# EAGLE board DMM-8E-2 (EAGLE 6.6.0)
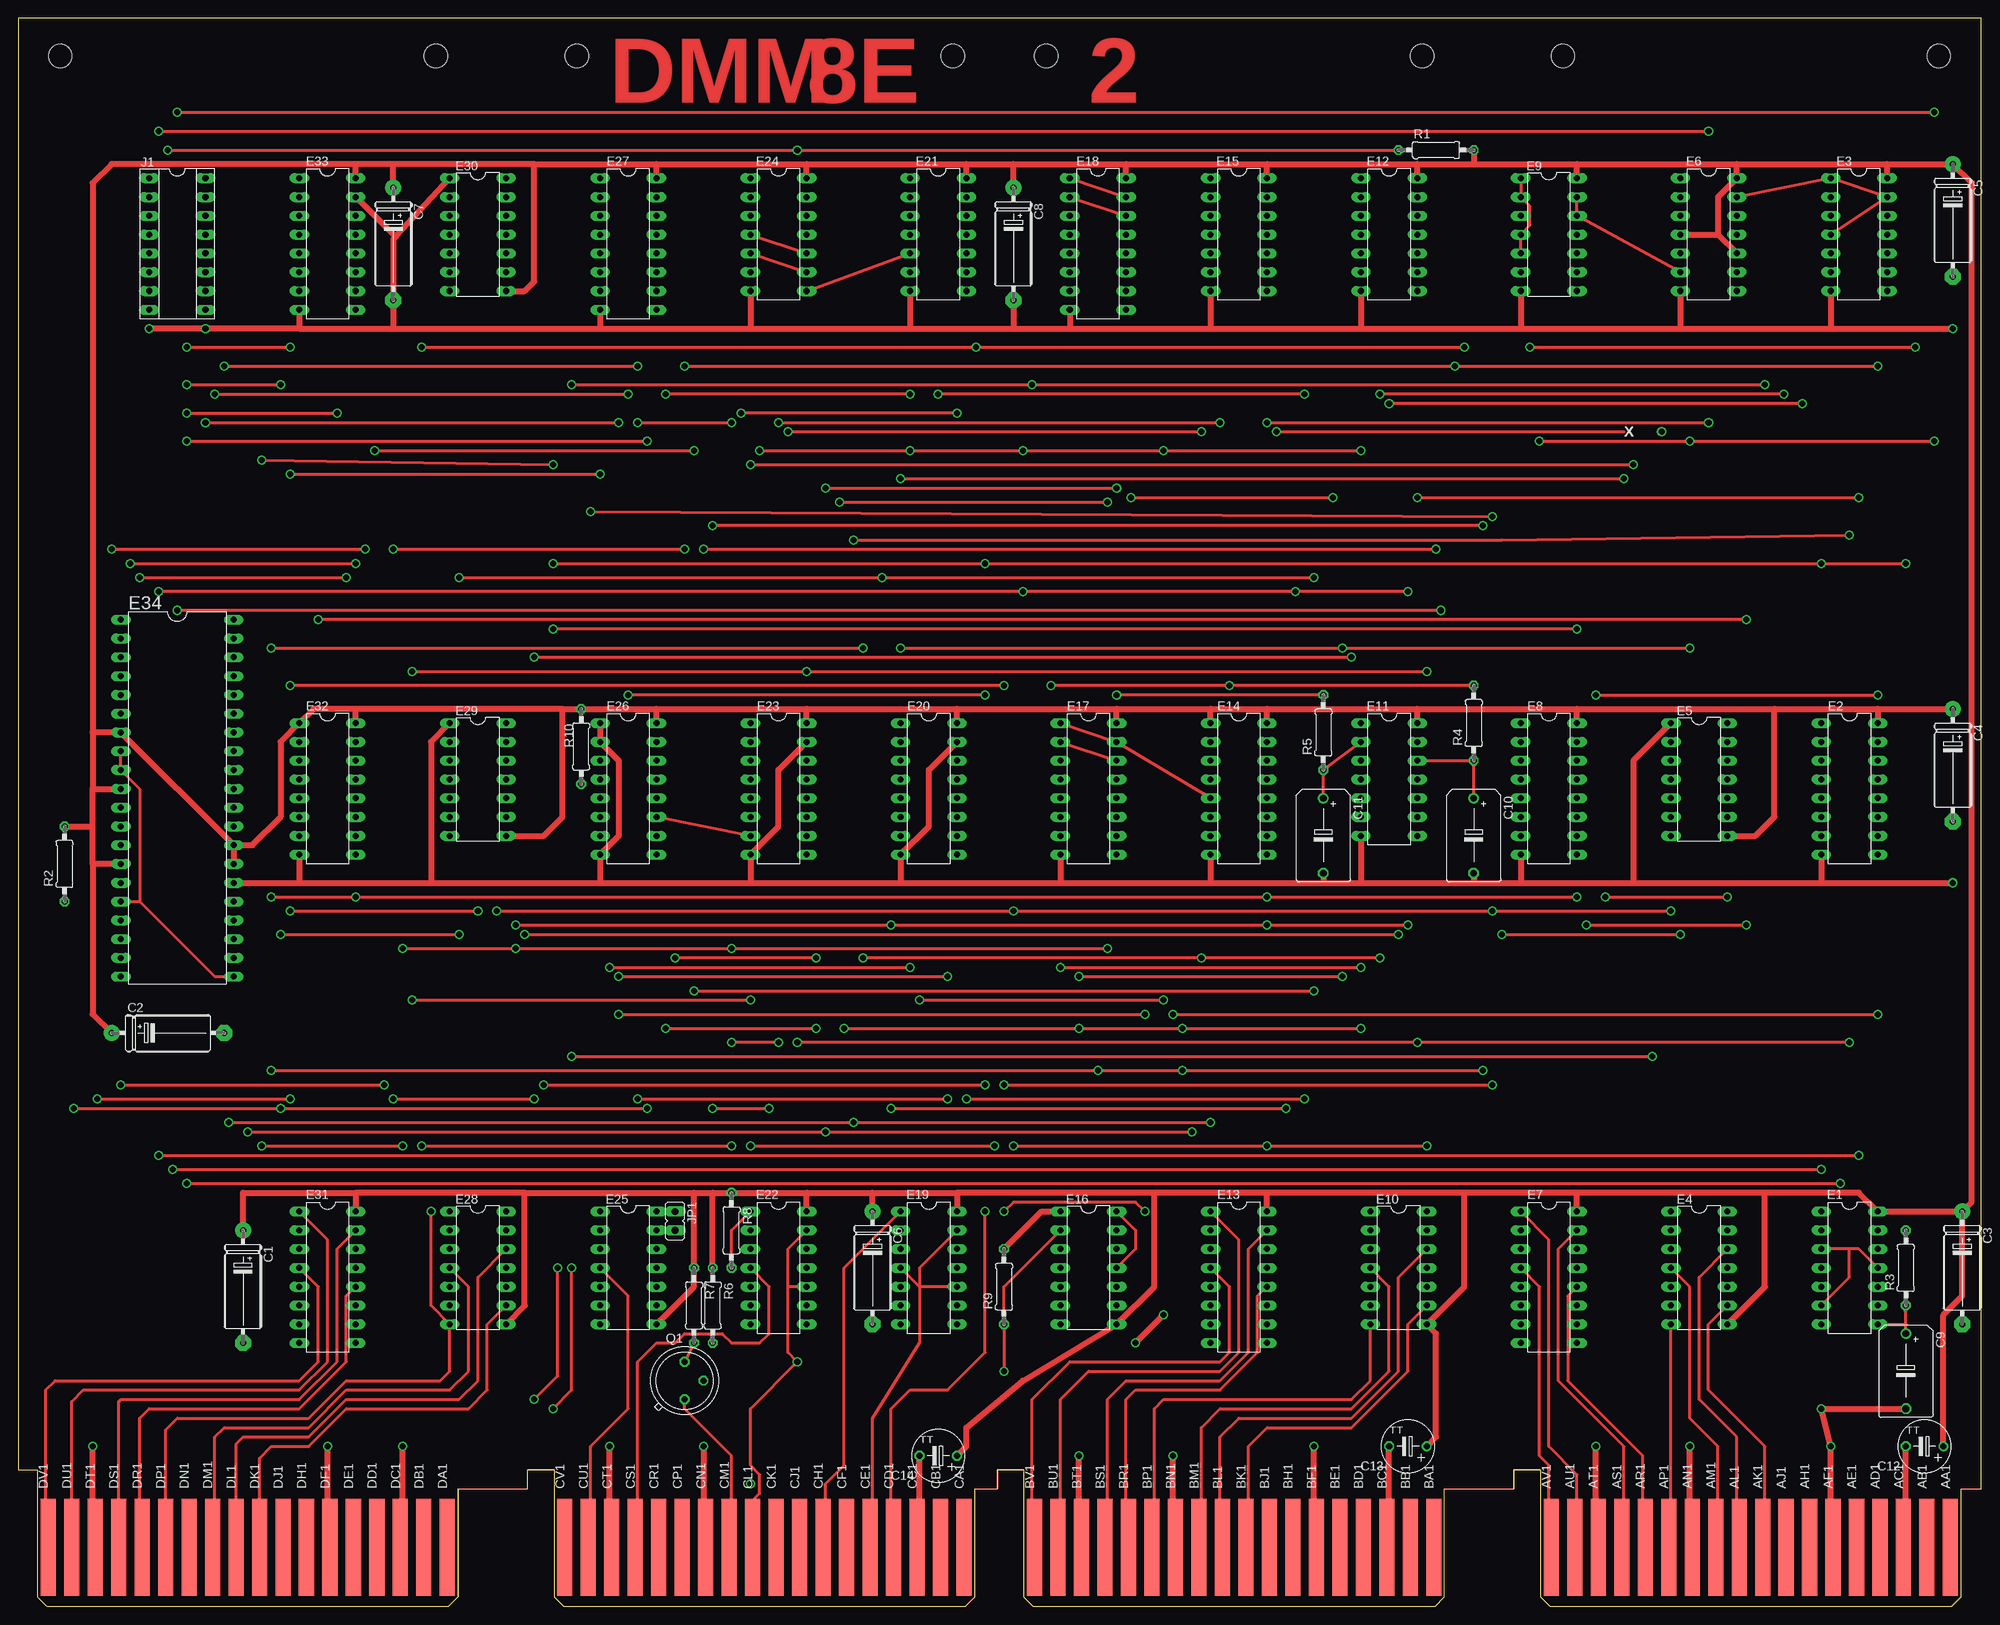
[diagram p2: board, top side]
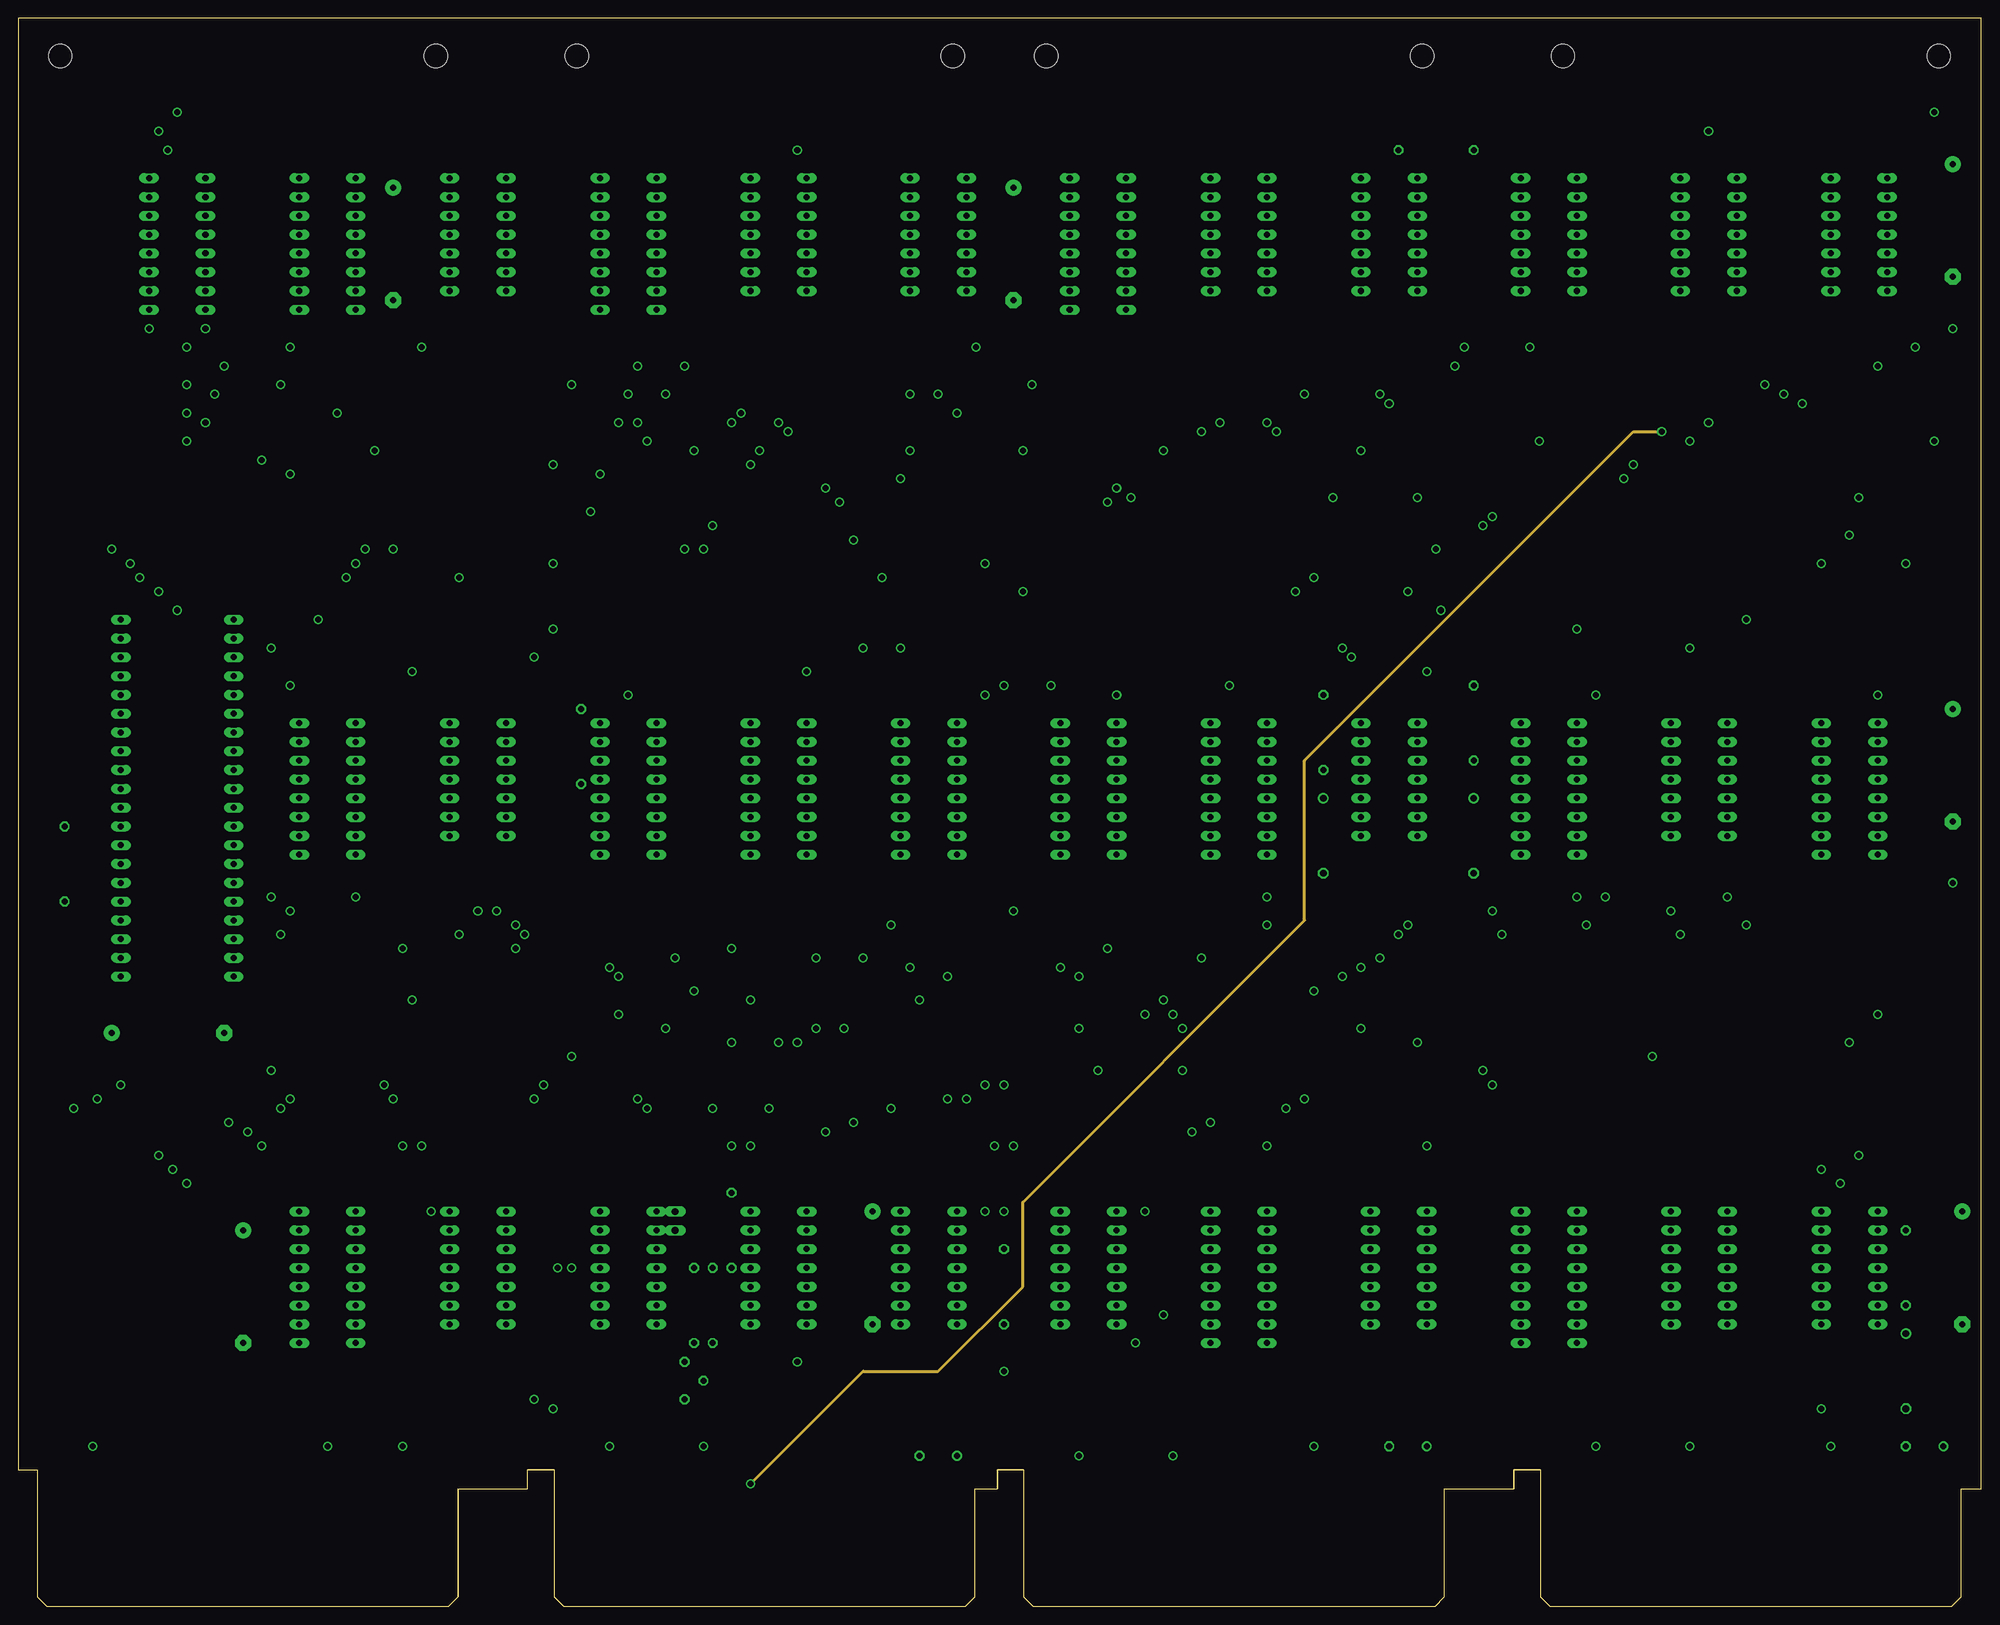
[diagram p3: board, inner layer Route15]
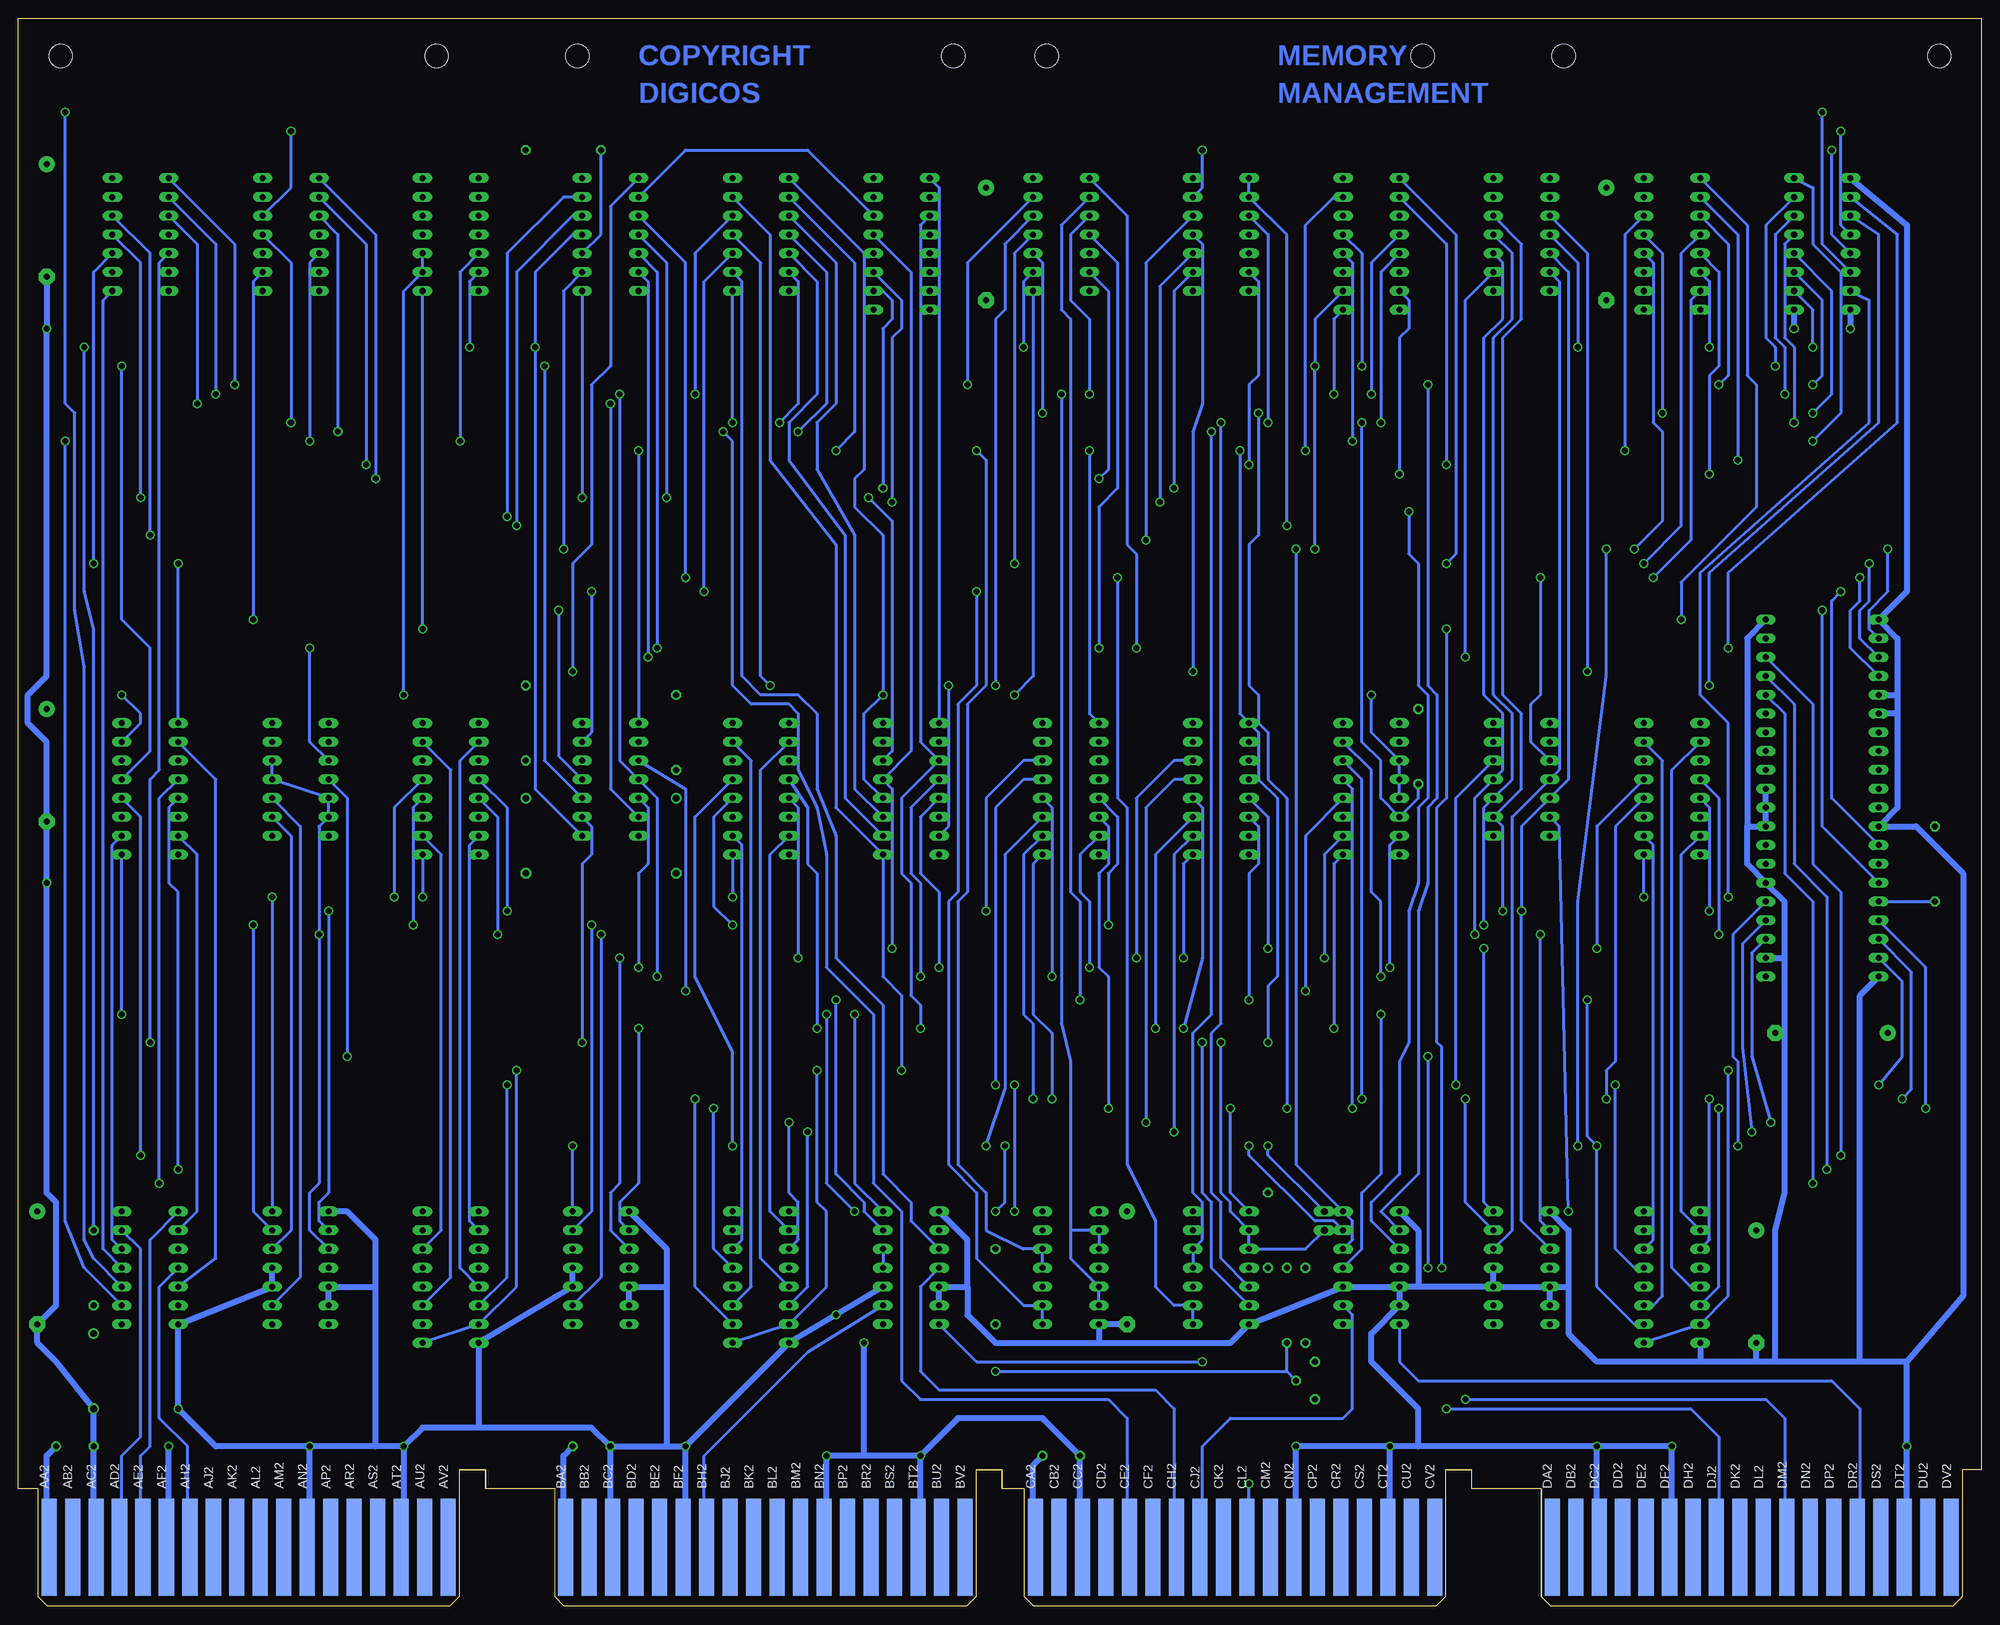
[diagram p4: board, bottom side, seen from below]

Size 265.3 x 214.63 mm. Coordinates in mm from the lower left corner, seen from the top.
Copper layers (1+15+16): Top 0.035mm / dielectric 1.5mm / Route15 0.035mm / dielectric 0.2mm / Bottom 0.035mm
Design rules "16mils *": minimum track width 16mil, minimum drill 32mil, track to track 15mil, track to pad 10mil, pad to pad 10mil, via to via 10mil, smd to smd 10mil, copper to edge 13mil, drill to drill 10mil, minimum pad ring 10mil, minimum via ring 8mil, stop-mask expansion 0mil, vias tented up to drill 0mil, thermal gap 10mil

## Footprints (pad centres in the part's own frame; a part is rotated, then mirrored left to right if it is on the bottom)
E15-5 = drill 0.813 pad 2.159: + -7.62,0 | drill 0.813 pad 2.159 octagon: - 7.62,0
B45181C = drill 0.914: + -5.08,0 | drill 0.914 octagon: - 5.08,0
TT5D7 = drill 0.813: + -2.54,0 | drill 0.813 octagon: - 2.54,0
DIL14 = drill 0.813 long: 1 -7.62,-3.81; 2 -5.08,-3.81; 3 -2.54,-3.81; 4 0,-3.81; 5 2.54,-3.81; 6 5.08,-3.81; 7 7.62,-3.81; 8 7.62,3.81; 9 5.08,3.81; 10 2.54,3.81; 11 0,3.81; 12 -2.54,3.81; 13 -5.08,3.81; 14 -7.62,3.81
DIL16 = drill 0.813 long: 1 -8.89,-3.81; 2 -6.35,-3.81; 3 -3.81,-3.81; 4 -1.27,-3.81; 5 1.27,-3.81; 6 3.81,-3.81; 7 6.35,-3.81; 8 8.89,-3.81; 9 8.89,3.81; 10 6.35,3.81; 11 3.81,3.81; 12 1.27,3.81; 13 -1.27,3.81; 14 -3.81,3.81; 15 -6.35,3.81; 16 -8.89,3.81
DIL40 = drill 0.813 long: 1 -24.13,-7.62; 2 -21.59,-7.62; 3 -19.05,-7.62; 4 -16.51,-7.62; 5 -13.97,-7.62; 6 -11.43,-7.62; 7 -8.89,-7.62; 8 -6.35,-7.62; 9 -3.81,-7.62; 10 -1.27,-7.62; 11 1.27,-7.62; 12 3.81,-7.62; 13 6.35,-7.62; 14 8.89,-7.62; 15 11.43,-7.62; 16 13.97,-7.62; 17 16.51,-7.62; 18 19.05,-7.62; 19 21.59,-7.62; 20 24.13,-7.62; 21 24.13,7.62; 22 21.59,7.62; 23 19.05,7.62; 24 16.51,7.62; 25 13.97,7.62; 26 11.43,7.62; 27 8.89,7.62; 28 6.35,7.62; 29 3.81,7.62; 30 1.27,7.62; 31 -1.27,7.62; 32 -3.81,7.62; 33 -6.35,7.62; 34 -8.89,7.62; 35 -11.43,7.62; 36 -13.97,7.62; 37 -16.51,7.62; 38 -19.05,7.62; 39 -21.59,7.62; 40 -24.13,7.62
SOCKET-16 = drill 0.813 long: 1 -8.89,-3.81; 2 -6.35,-3.81; 3 -3.81,-3.81; 4 -1.27,-3.81; 5 1.27,-3.81; 6 3.81,-3.81; 7 6.35,-3.81; 8 8.89,-3.81; 9 8.89,3.81; 10 6.35,3.81; 11 3.81,3.81; 12 1.27,3.81; 13 -1.27,3.81; 14 -3.81,3.81; 15 -6.35,3.81; 16 -8.89,3.81
JP1 = drill 0.914 long: 1 0,-1.27; 2 0,1.27
TO5 = drill 0.813 octagon: 1 0,-2.54; 2 2.54,0; 3 0,2.54
0207/10 = drill 0.813 octagon: 1 -5.08,0; 2 5.08,0
OMNIBUS = hole 3.175: 208.915,209.55; 259.715,209.55; 189.865,209.55; 139.065,209.55; 75.616,209.55; 126.416,209.55; 56.566,209.55; 5.766,209.55
EDGE-CON8 = smd 2.032 x 13.106: AA1 261.303,7.938; AB1 258.127,7.938; AC1 254.952,7.938; AD1 251.778,7.938; AE1 248.602,7.938; AF1 245.428,7.938; AH1 242.252,7.938; AJ1 239.077,7.938; AK1 235.903,7.938; AL1 232.727,7.938; AM1 229.553,7.938; AN1 226.377,7.938; AP1 223.202,7.938; AR1 220.028,7.938; AS1 216.852,7.938; AT1 213.678,7.938; AU1 210.502,7.938; AV1 207.327,7.938; BA1 191.452,7.938; BB1 188.278,7.938; BC1 185.102,7.938; BD1 181.928,7.938; BE1 178.752,7.938; BF1 175.577,7.938; BH1 172.403,7.938; BJ1 169.227,7.938; BK1 166.053,7.938; BL1 162.877,7.938; BM1 159.702,7.938; BN1 156.528,7.938; BP1 153.352,7.938; BR1 150.178,7.938; BS1 147.002,7.938; BT1 143.827,7.938; BU1 140.653,7.938; BV1 137.477,7.938; CA1 127.953,7.938; CB1 124.778,7.938; CC1 121.603,7.938; CD1 118.427,7.938; CE1 115.252,7.938; CF1 112.078,7.938; CH1 108.903,7.938; CJ1 105.728,7.938; CK1 102.552,7.938; CL1 99.377,7.938; CM1 96.203,7.938; CN1 93.028,7.938; CP1 89.853,7.938; CR1 86.677,7.938; CS1 83.502,7.938; CT1 80.328,7.938; CU1 77.153,7.938; CV1 73.978,7.938; DA1 58.102,7.938; DB1 54.928,7.938; DC1 51.752,7.938; DD1 48.578,7.938; DE1 45.403,7.938; DF1 42.227,7.938; DH1 39.053,7.938; DJ1 35.877,7.938; DK1 32.703,7.938; DL1 29.527,7.938; DM1 26.352,7.938; DN1 23.177,7.938; DP1 20.003,7.938; DR1 16.828,7.938; DS1 13.652,7.938; DT1 10.477,7.938; DU1 7.303,7.938; DV1 4.128,7.938 | smd 2.032 x 13.106 bottom: AA2 261.303,7.938; AB2 258.127,7.938; AC2 254.952,7.938; AD2 251.778,7.938; AE2 248.602,7.938; AF2 245.428,7.938; AH2 242.252,7.938; AJ2 239.077,7.938; AK2 235.903,7.938; AL2 232.727,7.938; AM2 229.553,7.938; AN2 226.377,7.938; AP2 223.202,7.938; AR2 220.028,7.938; AS2 216.852,7.938; AT2 213.678,7.938; AU2 210.502,7.938; AV2 207.327,7.938; BA2 191.452,7.938; BB2 188.278,7.938; BC2 185.102,7.938; BD2 181.928,7.938; BE2 178.752,7.938; BF2 175.577,7.938; BH2 172.403,7.938; BJ2 169.227,7.938; BK2 166.053,7.938; BL2 162.877,7.938; BM2 159.702,7.938; BN2 156.528,7.938; BP2 153.352,7.938; BR2 150.178,7.938; BS2 147.002,7.938; BT2 143.827,7.938; BU2 140.653,7.938; BV2 137.477,7.938; CA2 127.953,7.938; CB2 124.778,7.938; CC2 121.603,7.938; CD2 118.427,7.938; CE2 115.252,7.938; CF2 112.078,7.938; CH2 108.903,7.938; CJ2 105.728,7.938; CK2 102.552,7.938; CL2 99.377,7.938; CM2 96.203,7.938; CN2 93.028,7.938; CP2 89.853,7.938; CR2 86.677,7.938; CS2 83.502,7.938; CT2 80.328,7.938; CU2 77.153,7.938; CV2 73.978,7.938; DA2 58.102,7.938; DB2 54.928,7.938; DC2 51.752,7.938; DD2 48.578,7.938; DE2 45.403,7.938; DF2 42.227,7.938; DH2 39.053,7.938; DJ2 35.877,7.938; DK2 32.703,7.938; DL2 29.527,7.938; DM2 26.352,7.938; DN2 23.177,7.938; DP2 20.003,7.938; DR2 16.828,7.938; DS2 13.652,7.938; DT2 10.477,7.938; DU2 7.303,7.938; DV2 4.128,7.938

## Placement (x,y rotation side)
C1  10uF  [E15-5]  30.35,43.18 270 top
C2  10uF  [E15-5]  20.19,77.47 0 top
C3  10uF  [E15-5]  262.76,45.72 270 top
C4  10uF  [E15-5]  261.49,113.67 270 top
C5  10uF  [E15-5]  261.49,187.32 270 top
C6  10uF  [E15-5]  115.44,45.72 270 top
C7  10uF  [E15-5]  50.67,184.15 270 top
C8  10uF  [E15-5]  134.49,184.15 270 top
C9  820pF  [B45181C]  255.14,31.75 270 top
C10  820pF  [B45181C]  196.72,104.14 270 top
C11  820pF  [B45181C]  176.4,104.14 270 top
C12  15uF  [TT5D7]  257.68,21.59 180 top
C13  15uF  [TT5D7]  187.83,21.59 180 top
C14  15uF  [TT5D7]  124.33,20.32 180 top
E1  7401N  [DIL14]  247.52,45.72 270 top
E2  74175N  [DIL16]  247.52,110.49 270 top
E3  7474N  [DIL14]  248.79,185.42 270 top
E4  SP380N  [DIL14]  227.2,45.72 270 top
E5  SP314N  [DIL14]  227.2,111.76 270 top
E6  7474N  [DIL14]  228.47,185.42 270 top
E7  DS8641N  [DIL16]  206.88,44.45 270 top
E8  74175N  [DIL16]  206.88,110.49 270 top
E9  74H40N  [DIL14]  206.88,185.42 270 top
E10  SP380N  [DIL14]  186.56,45.72 270 top
E11  7400N  [DIL14]  185.29,111.76 270 top
E12  7404N  [DIL14]  185.29,185.42 270 top
E13  DS8641N  [DIL16]  164.97,44.45 270 top
E14  74175N  [DIL16]  164.97,110.49 270 top
E15  7404N  [DIL14]  164.97,185.42 270 top
E16  SP380N  [DIL14]  144.65,45.72 270 top
E17  74155N  [DIL16]  144.65,110.49 270 top
E18  74155N  [DIL16]  145.92,184.15 270 top
E19  7401N  [DIL14]  123.06,45.72 270 top
E20  74LS257N  [DIL16]  123.06,110.49 270 top
E21  7408N  [DIL14]  124.33,185.42 270 top
E22  7401N  [DIL14]  102.74,45.72 270 top
E23  74LS257N  [DIL16]  102.74,110.49 270 top
E24  7410N  [DIL14]  102.74,185.42 270 top
E25  SP380N  [DIL14]  82.42,45.72 270 top
E26  I3107  [DIL16]  82.42,110.49 270 top
E27  74175N  [DIL16]  82.42,184.15 270 top
E28  SP380N  [DIL14]  62.1,45.72 270 top
E29  SP314N  [DIL14]  62.1,111.76 270 top
E30  SP314N  [DIL14]  62.1,185.42 270 top
E31  DS8641N  [DIL16]  41.78,44.45 270 top
E32  74175N  [DIL16]  41.78,110.49 270 top
E33  74LS257N  [DIL16]  41.78,184.15 270 top
E34  AM2901  [DIL40]  21.46,109.22 270 top
J1  [SOCKET-16]  21.46,184.15 270 top
JP1  [JP1]  88.77,52.07 180 top
Q1  OPEN  [TO5]  90.04,30.48 0 top
R1  2.2K  [0207/10]  191.64,196.85 0 top
R2  680  [0207/10]  6.22,100.33 90 top
R3  220  [0207/10]  255.14,45.72 90 top
R4  220  [0207/10]  196.72,119.38 90 top
R5  220  [0207/10]  176.4,118.11 90 top
R6  220  [0207/10]  93.85,40.64 270 top
R7  10  [0207/10]  91.31,40.64 270 top
R8  2400  [0207/10]  96.39,50.8 270 top
R9  470  [0207/10]  133.22,43.18 90 top
R10  680  [0207/10]  76.07,116.2 270 top
U$1  OUTLINE-OMNIBUS  [OMNIBUS]  -0.13,0 0 top
U$2  QUAD  [EDGE-CON8]  -0.13,0 0 top

## Tracks (layer width: path | path; a pad name or v marks a point on that pad's centre or on a via)
!BCPMA_DISABLE  (via drill 0.81)
  Top 0.406: v197.99,146.05 v93.85,146.05
  Bottom 0.406: E12.12 190.37,187.96 197.99,180.34 v197.99,146.05 | v93.85,146.05 93.85,185.42 E24.2 E24.1
!C0
  Top 0.406: U$2.CE1 115.44,8.26 115.44,25.4 121.79,35.56 121.79,43.18 | E19.4 121.79,43.18 | E19.13 121.79,45.72 121.79,43.18 | E19.10 121.79,43.18
!C1
  Top 0.406: U$2.CH1 109.09,8.26 109.09,16.51 111.63,19.05 111.63,45.72 E19.1
!CMME  (via drill 0.81)
  Top 0.406: v143.38,85.09 v178.94,85.09 | v238.63,163.83 v184.02,163.83
  Bottom 0.406: E3.2 238.63,184.15 v238.63,163.83 | v184.02,163.83 184.02,114.3 E11.4 178.94,109.22 v178.94,85.09 | E17.4 144.65,107.95 144.65,99.06 143.38,97.79 v143.38,85.09
!CPMA_DISABLE
  Top 0.406: U$2.CU1 77.34,8.26 77.34,21.59 82.42,26.67 82.42,41.91 E25.4
!DATA00
  Top 0.406: E7.12 209.42,41.91 209.42,30.48 219.58,20.32 219.58,8.26 U$2.AR1
!DATA01
  Top 0.406: U$2.AS1 217.04,8.26 217.04,21.59 208.15,30.48 208.15,48.26 E7.15
!DATA02
  Top 0.406: U$2.AU1 210.69,8.26 210.69,17.78 206.88,21.59 206.88,49.53 E7.1
!DATA03
  Top 0.406: U$2.AV1 206.88,8.26 206.88,19.05 205.61,20.32 205.61,43.18 E7.4
!DATA04
  Top 0.406: U$2.BR1 149.73,8.26 149.73,27.94 151,29.21 162.43,29.21 167.51,34.29 167.51,41.91 E13.12
!DATA05
  Top 0.406: U$2.BS1 147.19,8.26 147.19,27.94 149.73,30.48 162.43,30.48 166.24,34.29 166.24,48.26 E13.15
!DATA06
  Top 0.406: U$2.BU1 140.84,8.26 140.84,27.94 144.65,31.75 162.43,31.75 164.97,34.29 164.97,49.53 E13.1
!DATA07
  Top 0.406: U$2.BV1 137.03,8.26 137.03,27.94 142.11,33.02 162.43,33.02 163.7,34.29 163.7,43.18 E13.4
!DATA08
  Top 0.406: U$2.DR1 16.38,8.89 16.38,25.4 16.7,25.72 17.65,26.67 37.97,26.67 44.32,33.02 44.32,41.91 E31.12
!DATA09
  Top 0.406: U$2.DS1 13.52,27.62 13.84,27.94 37.97,27.94 43.05,33.02 43.05,48.26 E31.15
!DATA10
  Top 0.406: U$2.DU1 7.18,27.62 8.76,29.21 37.97,29.21 41.78,33.02 41.78,49.53 E31.1
!DATA11
  Top 0.406: U$2.DV1 4,8.57 3.68,8.89 3.68,29.21 4.95,30.48 37.97,30.48 40.51,33.02 40.51,43.18 E31.4
!EMA0
  Bottom 0.406: U$2.AD2 251.33,8.26 251.33,20.32 248.79,22.86 248.79,48.26 E1.13
!EMA1
  Bottom 0.406: E1.1 247.52,49.53 247.52,21.59 248.79,20.32 248.79,8.26 U$2.AE2
!EMA2
  Bottom 0.406: E1.4 246.25,43.18 246.25,25.4 242.44,21.59 242.44,8.26 U$2.AH2
!F  (via drill 0.81)
  Top 0.406: v72.26,26.67 74.8,29.21 v74.8,45.72 | v74.8,74.3 v220.85,74.3
  Bottom 0.406: v72.26,26.67 39.24,26.67 35.43,22.86 35.43,8.26 U$2.DJ2 | v74.8,74.3 v74.8,45.72 | E5.4 220.85,109.22 v220.85,74.3
!F_SET
  Bottom 0.406: E25.7 78.61,33.02 76.07,30.48 20.19,30.48 16.38,26.67 16.38,8.26 U$2.DR2
!IFDF_CLR  (via drill 0.81)
  Top 0.406: v133.22,124.46 v36.7,124.46
  Bottom 0.406: v36.7,124.46 36.7,139.7 13.84,160.02 13.84,185.42 J1.3 | E21.12 131.95,184.15 131.95,175.26 133.22,173.99 v133.22,124.46
!INTERNAL_IO  (via drill 0.81)
  Top 0.406: U$2.CL1 98.93,8.26 98.93,13.97 100.2,15.24 100.2,17.78 98.93,19.05 98.93,26.67 v105.28,33.02 104.01,34.29 104.01,43.18 | 104.01,43.18 104.01,48.26 E22.13 | E22.10 104.01,43.18
  Bottom 0.406: E16.7 135.76,33.02 v105.28,33.02
!IO_PAUSE  (via drill 0.81)
  Top 0.406: U$2.CD1 117.98,8.26 117.98,26.67 120.52,29.21 125.6,29.21 130.68,34.29 v130.68,53.34 | v70.99,70.48 v130.68,70.48
  Bottom 0.406: v70.99,70.48 70.99,109.22 E29.12 | v130.68,70.48 v130.68,53.34
!IOT2X5  (via drill 0.81)
  Top 0.406: v150.37,149.86 v177.67,149.86 | E17.2 E17.14
  Bottom 0.406: E17.14 147.19,115.57 147.19,146.69 v150.37,149.86 | E12.4 177.67,181.61 v177.67,149.86
!IOT21_45  (via drill 0.81)
  Top 0.406: v109.09,151.13 v148.46,151.13 | E24.5 E24.9
  Bottom 0.406: E18.10 148.46,177.8 147.19,176.53 147.19,173.99 148.46,172.72 v148.46,151.13 | E24.9 109.09,177.8 v109.09,151.13
!IOT22_45  (via drill 0.81)
  Top 0.406: v111,149.22 v147.19,149.22 | E24.4 E24.10
  Bottom 0.406: E18.11 145.92,176.53 145.92,172.72 147.19,171.45 v147.19,149.22 | E24.10 111,178.44 v111,149.22
!LOAD_CNTL  (via drill 0.81)
  Top 0.406: v81.15,80.01 v152.27,80.01 | E16.14 151,50.8 151,48.26 E16.11
  Bottom 0.406: v152.27,80.01 152.27,57.15 E16.14 | v81.15,80.01 81.15,58.42 83.69,55.88 83.69,48.26 E25.11 | E16.12 E16.11
!LRM  (via drill 0.81)
  Top 0.406: R4.2 v163.7,124.46 v139.57,124.46
  Bottom 0.406: v163.7,124.46 164.97,125.73 164.97,181.61 E15.11 | v139.57,124.46 139.57,105.41 E17.7
!LTM  (via drill 0.81)
  Top 0.406: R5.2 v148.46,123.19
  Bottom 0.406: E17.12 151,111.76 151,120.65 v148.46,123.19 148.46,144.78 152.27,148.59 152.27,152.4 151,153.67 151,182.88 E15.1
!MASKED  (via drill 0.81)
  Top 0.406: v98.93,154.31 v218.31,154.31
  Bottom 0.406: E6.2 218.31,184.15 v218.31,154.31 | E24.6 97.66,179.07 97.66,166.37 98.93,165.1 v98.93,154.31
!MD00
  Top 0.406: U$2.AK1 236.09,8.26 236.09,21.59 228.47,29.21 228.47,38.1 E4.9
  Bottom 0.406: E5.10 227.2,105.41 227.2,44.45 E4.9
!MD01
  Top 0.406: U$2.AL1 232.28,8.26 232.28,22.86 227.2,27.94 227.2,44.45 E4.12
  Bottom 0.406: E5.9 228.47,104.14 228.47,50.8 E4.12
!MD02
  Top 0.406: U$2.AM1 229.74,8.26 229.74,21.59 225.93,25.4 225.93,43.18 E4.4
!MD03
  Top 0.406: U$2.AP1 223.39,8.26 E4.7
!MD04  (via drill 0.81)
  Top 0.406: U$2.BK1 166.24,8.26 166.24,21.59 168.78,24.13 180.21,24.13 187.83,31.75 187.83,38.1 E10.9 | v68.45,90.81 v186.56,90.81
  Bottom 0.406: E10.9 186.56,44.45 v186.56,90.81 | E30.10 64.64,181.61 64.64,173.99 67.18,171.45 67.18,123.19 64.64,120.65 64.64,113.03 E29.11 68.45,109.22 v68.45,90.81
!MD05
  Top 0.406: U$2.BL1 162.43,8.26 162.43,22.86 164.97,25.4 180.21,25.4 186.56,31.75 186.56,44.45 E10.12
!MD06
  Top 0.406: U$2.BM1 159.89,8.26 159.89,24.13 162.43,26.67 180.21,26.67 185.29,31.75 185.29,43.18 E10.4
!MD07
  Top 0.406: U$2.BP1 153.54,8.89 153.54,26.67 154.81,27.94 180.21,27.94 182.75,30.48 E10.7
!MD08
  Top 0.406: U$2.DK1 32.58,20 34.16,21.59 39.24,21.59 44.32,26.67 60.83,26.67 63.37,29.21 63.37,38.1 E28.9
!MD09
  Top 0.406: U$2.DL1 29.4,21.91 30.35,22.86 39.24,22.86 44.32,27.94 59.56,27.94 62.1,30.48 62.1,44.45 E28.12
  Bottom 0.406: E28.12 63.37,50.8 63.37,106.68 E29.4 57.02,113.03 57.02,179.07 E30.6
!MD10
  Top 0.406: U$2.DM1 26.54,8.89 26.54,22.86 27.81,24.13 39.24,24.13 44.32,29.21 58.29,29.21 60.83,31.75 60.83,43.18 E28.4
!MD11  (via drill 0.81)
  Top 0.406: U$2.DP1 19.88,23.81 21.46,25.4 39.24,25.4 44.32,30.48 57.02,30.48 58.29,31.75 E28.7 55.75,40.64 v55.75,53.34
  Bottom 0.406: v55.75,53.34 57.02,105.41 E29.6
!NOT_LAST_XFR
  Top 0.406: U$2.CM1 96.39,8.26 96.39,20.32 90.04,26.67 Q1.1
!RTM  (via drill 0.81)
  Top 0.406: v34.16,72.39 v145.92,72.39 v157.35,72.39 v197.99,72.39
  Bottom 0.406: E31.9 E31.7 34.16,41.91 v34.16,72.39 | E7.9 E7.7 197.99,43.18 v197.99,72.39 | E13.9 E13.7 156.08,43.18 156.08,53.34 157.35,54.61 v157.35,72.39 | E15.13 163.7,185.42 163.7,154.94 154.81,143.51 154.81,107.95 E17.9 148.46,85.09 145.92,82.55 v145.92,72.39
!SKIP
  Top 0.406: U$2.CS1 83.69,8.26 83.69,33.02 86.23,35.56 88.77,35.56 90.04,36.83 95.12,36.83 96.39,35.56 100.2,35.56 101.47,36.83 101.47,43.18 E22.4
!SKME
  Bottom 0.406: E17.10 153.54,109.22 153.54,144.78 161.16,154.94 161.16,160.02 157.35,163.83 157.35,179.07 E15.5
!SKMM
  Bottom 0.406: E15.3 154.81,181.61 154.81,162.56 157.35,160.02 157.35,153.67 152.27,144.78 152.27,110.49 E17.11
!SMME  (via drill 0.81)
  Top 0.406: v140.84,86.36 v181.48,86.36
  Bottom 0.406: E11.5 180.21,107.95 180.21,100.33 181.48,99.06 v181.48,86.36 | E17.5 143.38,106.68 143.38,99.06 140.84,96.52 v140.84,86.36
!TP3
  Bottom 0.406: E15.9 167.51,179.07 167.51,125.73 164.97,123.19 159.89,123.19 157.35,120.65 157.35,110.49 154.81,104.14 154.81,87.63 148.46,81.28 148.46,58.42 144.65,54.61 144.65,52.07 E16.3
!TP4  (via drill 0.81)
  Top 0.406: v92.58,142.88 v191.64,142.88
  Bottom 0.406: E12.9 191.64,177.8 v191.64,142.88 | v92.58,142.88 92.58,59.69 E25.14 84.96,52.07 84.96,49.53 E25.12
!TS2  (via drill 0.81)
  Route15 0.406: v98.93,16.51 114.17,31.75 124.33,31.75 135.76,43.18 135.76,54.61 173.86,92.71 173.86,114.3 218.31,158.75 v222.12,158.75
  Bottom 0.406: U$2.CL2 98.93,8.26 v98.93,16.51 | E6.3 222.12,185.42 v222.12,158.75
!USER_MODE  (via drill 0.81)
  Top 0.406: v69.72,27.94 72.9,31.11 v72.9,45.72 | v210.69,132.08 v72.26,132.08
  Bottom 0.406: v69.72,27.94 29.08,27.94 26.54,25.4 26.54,8.26 U$2.DM2 | v72.9,45.72 72.9,75.56 73.53,76.2 73.53,107.95 72.26,109.22 v72.26,132.08 | v210.69,132.08 E9.8
BLOAD_CNTL  (via drill 0.81)
  Top 0.406: v121.79,81.92 v154.81,81.92
  Bottom 0.406: v154.81,81.92 154.81,58.42 151,54.61 151,53.34 E16.13 | E21.2 124.33,186.69 124.33,175.26 123.06,173.99 123.06,96.52 121.79,95.25 v121.79,81.92
BTP3  (via drill 0.81)
  Top 0.406: v168.78,160.02 v228.47,160.02
  Bottom 0.406: E6.11 228.47,181.61 v228.47,160.02 | v168.78,160.02 E15.8
BTP4  (via drill 0.81)
  Top 0.406: v189.1,149.86 v248.79,149.86
  Bottom 0.406: E3.11 248.79,181.61 v248.79,149.86 | E12.8 v189.1,149.86
CPMA_DISABLE  (via drill 0.81)
  Top 0.406: v77.34,147.96 v199.26,147.32
  Bottom 0.406: E12.13 191.64,190.5 199.26,182.88 v199.26,147.32 | v77.34,147.96 77.34,142.24 76.07,140.97 76.07,124.46 74.8,123.19 74.8,109.22 76.07,107.95 76.07,97.79 77.34,93.98 77.34,76.2 78.61,73.66 78.61,58.42 82.42,54.61 82.42,52.07 E25.3
CSMME  (via drill 0.81)
  Top 0.406: v241.17,162.56 v185.29,162.56
  Bottom 0.406: E11.6 185.29,110.49 v185.29,162.56 | E3.3 241.17,184.15 v241.17,162.56
DATA03  (via drill 0.81)
  Top 0.406: v133.22,70.48 v199.26,70.48
  Bottom 0.406: E7.6 199.26,44.45 v199.26,70.48 | E20.13 129.41,111.76 133.22,107.95 v133.22,70.48
DATA04  (via drill 0.81)
  Top 0.406: v128.14,68.58 v173.86,68.58
  Bottom 0.406: E13.10 173.86,43.18 v173.86,68.58 | E20.10 129.41,101.6 129.41,80.01 128.14,78.74 v128.14,68.58
DATA05  (via drill 0.81)
  Top 0.406: v117.98,67.31 v171.32,67.31
  Bottom 0.406: E13.13 171.32,48.26 v171.32,67.31 | E20.6 117.98,105.41 117.98,100.33 119.25,99.06 119.25,86.36 117.98,85.09 v117.98,67.31
DATA06  (via drill 0.81)
  Top 0.406: v28.45,65.41 v112.9,65.41 v161.16,65.41
  Bottom 0.406: E34.23 30.99,88.27 30.99,74.3 v28.45,65.41 | E13.3 159.89,49.53 159.89,54.61 161.16,55.88 v161.16,65.41 | E23.13 109.09,111.76 112.9,107.95 v112.9,65.41
DATA07  (via drill 0.81)
  Top 0.406: v30.99,64.14 v109.09,64.14 v158.62,64.14
  Bottom 0.406: E34.24 32.26,89.53 32.26,75.56 v30.99,64.14 | E13.6 158.62,43.18 v158.62,64.14 | E23.10 109.09,101.6 v109.09,64.14
DATA08  (via drill 0.81)
  Top 0.406: v32.89,62.23 v51.94,62.23 | v53.21,81.92 v98.93,81.92
  Bottom 0.406: E34.25 33.53,90.81 33.53,74.3 32.89,73.66 v32.89,62.23 | E31.10 46.86,38.1 51.94,43.18 v51.94,62.23 53.21,63.5 v53.21,81.92 | E23.6 97.66,105.41 97.66,100.33 98.93,99.06 v98.93,81.92
DATA09  (via drill 0.81)
  Top 0.406: v13.84,70.48 v49.4,70.48
  Bottom 0.406: v13.84,70.48 10.67,74.3 10.67,84.45 E34.19 | E31.13 46.86,45.72 49.4,48.26 v49.4,70.48
DATA10  (via drill 0.81)
  Top 0.406: v10.67,68.58 v36.7,68.58
  Bottom 0.406: v10.67,68.58 9.4,69.85 9.4,85.72 E34.18 | E31.3 36.7,49.53 v36.7,68.58
DATA11  (via drill 0.81)
  Top 0.406: v7.49,67.31 v35.43,67.31 v84.96,67.31
  Bottom 0.406: v7.49,67.31 7.49,86.36 E34.17 | E31.6 35.43,43.18 v35.43,67.31 | v84.96,67.31 84.96,110.49 E26.13
DB_LOAD  (via drill 0.81)
  Top 0.406: v18.92,199.39 v228.47,199.39
  Bottom 0.406: J1.4 18.92,186.69 v18.92,199.39 | E6.12 228.47,191.77 v228.47,199.39
DF0_IN  (via drill 0.81)
  Top 0.406: v22.73,161.29 v43.05,161.29
  Bottom 0.406: v43.05,161.29 43.05,182.88 E33.13 | J1.12 20.19,177.8 20.19,163.83 v22.73,161.29
DF1_IN  (via drill 0.81)
  Top 0.406: v22.73,165.1 v35.43,165.1
  Bottom 0.406: E33.3 34.16,184.15 34.16,166.37 v35.43,165.1 | J1.11 21.46,176.53 21.46,166.37 v22.73,165.1
DF2_IN  (via drill 0.81)
  Top 0.406: v22.73,170.18 v36.7,170.18
  Bottom 0.406: E33.6 36.7,179.07 v36.7,170.18 | J1.10 22.73,175.26 v22.73,170.18
F_SET  (via drill 0.81)
  Top 0.406: v74.8,165.1 v137.03,165.1 v236.09,165.1 | E6.13 E3.1 E3.13 E3.4
  Bottom 0.406: E3.1 236.09,184.15 v236.09,165.1 | E21.13 137.03,181.61 v137.03,165.1 | v74.8,165.1 74.8,124.46 73.53,123.19 73.53,109.22 74.8,107.95 74.8,97.79 76.07,93.98 76.07,58.42 81.15,53.34 E25.2
GND  (via drill 0.81)
  Top 0.813: v41.78,21.59 41.78,8.26 U$2.DF1 | U$2.DC1 51.94,8.26 v51.94,21.59 | U$2.CT2 79.88,8.26 v79.88,21.59 | v92.58,21.59 92.58,7.62 U$2.CN2 | U$2.CC1 121.79,8.26 C14.- | U$2.BF2 175.13,8.26 v175.13,21.59 | U$2.BC2 185.29,8.26 C13.- | U$2.BN2 156.08,8.26 v156.08,20.32 | U$2.BT2 143.38,8.26 v143.38,20.32 | U$2.AT2 213.23,8.26 v213.23,21.59 | U$2.AN2 225.93,8.26 v225.93,21.59 | U$2.AF2 244.98,8.26 v244.98,21.59 v243.71,26.67 C9.- | U$2.AC2 255.14,8.26 C12.- | E5.1 218.31,114.3 218.31,97.79 | E34.26 37.97,97.79 | 37.97,97.79 55.75,97.79 | 55.75,97.79 78.61,97.79 | 78.61,97.79 98.93,97.79 | 98.93,97.79 119.25,97.79 | 119.25,97.79 140.84,97.79 | 140.84,97.79 161.16,97.79 | 161.16,97.79 176.4,97.79 | 176.4,97.79 181.48,97.79 | 181.48,97.79 196.72,97.79 | 196.72,97.79 203.07,97.79 | 203.07,97.79 218.31,97.79 | 218.31,97.79 243.71,97.79 | 243.71,97.79 v261.49,97.79 | E2.8 243.71,97.79 | E8.8 203.07,97.79 | E11.7 181.48,97.79 | E14.8 161.16,97.79 | E17.8 140.84,97.79 | 98.93,97.79 E23.8 102.74,105.41 102.74,113.03 E23.15 | 119.25,97.79 E20.8 123.06,105.41 123.06,113.03 E20.15 | E32.8 37.97,97.79 | E29.1 55.75,116.84 55.75,97.79 | E33.8 37.97,172.72 | 37.97,172.72 v25.27,172.72 v17.65,172.72 | 37.97,172.72 50.67,172.72 | 50.67,172.72 78.61,172.72 | 78.61,172.72 98.93,172.72 | 98.93,172.72 120.52,172.72 | 120.52,172.72 134.49,172.72 | 134.49,172.72 142.11,172.72 | 142.11,172.72 161.16,172.72 | 161.16,172.72 181.48,172.72 | 181.48,172.72 203.07,172.72 | 203.07,172.72 224.66,172.72 | 224.66,172.72 244.98,172.72 | 244.98,172.72 v261.49,172.72 | E3.7 244.98,172.72 | E6.7 224.66,172.72 | E9.7 203.07,172.72 | E12.7 181.48,172.72 | E15.7 161.16,172.72 | E18.8 142.11,172.72
  Top 0.813: E21.7 120.52,172.72 | E24.7 98.93,172.72 | E27.8 78.61,172.72 | E30.1 50.99,185.13 | 50.99,185.13 50.67,184.78 C7.- 50.67,172.72 | C8.- 134.49,172.72 | U$2.DT1 10.03,8.26 v10.03,21.59 | v151,35.56 v154.81,39.37 | C11.- 176.4,97.79 | C10.- 196.72,97.79 | R9.2 138.3,53.34 E16.1 | 78.61,97.79 E26.8 81.15,104.14 81.15,114.3 E26.2 E26.1 | E33.15 45.62,190.5 50.99,185.13
  Bottom 0.813: U$2.CC1 121.79,8.26 C14.- 126.87,25.4 138.3,25.4 v143.38,20.32 | v143.38,20.32 151,20.32 | 151,20.32 v156.08,20.32 156.08,8.26 U$2.BN2 | 151,20.32 v151,35.56 | U$2.BT2 143.38,8.26 v143.38,20.32 | U$2.BF2 175.13,8.26 v175.13,21.59 | v175.13,21.59 E13.8 v154.81,39.37 E16.10 | U$2.BC2 185.29,8.26 C13.- | C13.- 177.67,21.59 | 177.67,21.59 v175.13,21.59 | C13.- 187.83,24.13 203.07,24.13 | 203.07,24.13 210.69,24.13 v213.23,21.59 | v213.23,21.59 213.23,8.89 213.55,8.57 U$2.AT2 | v213.23,21.59 217.04,21.59 | 217.04,21.59 v225.93,21.59 | v225.93,21.59 238.63,21.59 v243.71,26.67 E1.7 E4.10 E4.11 | 217.04,21.59 217.04,43.18 | 217.04,43.18 217.04,49.53 220.85,53.34 E4.1 | 41.78,8.89 v41.78,21.59 v51.94,21.59 | v51.94,21.59 76.07,21.59 | 76.07,21.59 v79.88,21.59 | U$2.DC1 51.94,8.26 v51.94,21.59 | U$2.CT2 79.88,8.26 v79.88,21.59 | U$2.CN2 92.58,8.26 v92.58,21.59 v79.88,21.59 | U$2.AN2 225.93,8.26 v225.93,21.59 | v51.94,21.59 v79.88,21.59 | U$2.DT1 10.03,8.26 v10.03,21.59 10.03,33.02 | U$2.AC2 255.14,8.26 C12.- C9.- 260.22,33.02 262.76,35.56 C3.- 260.22,40.64 260.22,54.61 261.49,55.88 v261.49,97.79 C4.- 261.49,116.84 264.03,119.38 264.03,123.19 261.49,125.73 v261.49,172.72 C5.- | U$2.AF2 244.98,8.26 v244.98,21.59 | C6.- E19.7 119.25,35.56 | 41.78,8.89 41.78,8.26 U$2.DF1 42.1,8.57 41.78,8.89 | 10.03,33.02 16.38,33.02 | 16.38,33.02 27.81,33.02 | 27.81,33.02 30.35,33.02 | 30.35,33.02 C1.- | 30.35,33.02 37.97,33.02 | 37.97,33.02 51.94,33.02 55.75,36.83 55.75,43.18 | E31.8 37.97,33.02 | E28.1 55.75,50.8 55.75,43.18 | E28.5 55.75,43.18 | E28.10 E28.11 | E28.10 E28.5 | E28.6 E28.5 | E28.10 76.07,43.18 | 76.07,43.18 E25.5 | E25.5 E25.6 82.42,36.83 82.42,33.02 76.07,26.67 76.07,21.59
  Bottom 0.813: E25.5 E25.10 E22.7 101.47,35.56 119.25,35.56 | 27.81,33.02 27.81,50.8 26.54,55.88 26.54,77.47 | C2.- 26.54,77.47 | 26.54,77.47 26.54,87.63 | 26.54,87.63 26.54,95.25 E34.26 31.62,100.33 31.62,105.41 | E34.22 26.54,87.63 | 31.62,105.41 E34.29 E34.30 E34.31 | E34.40 31.62,130.81 31.62,105.41 | 16.38,33.02 16.38,82.55 E34.20 | 11.3,123.19 11.3,130.81 E34.1 10.03,137.16 10.03,186.69 J1.1 | 11.3,123.19 11.3,120.65 | 11.3,120.65 11.3,107.95 E34.12 8.76,105.41 2.41,99.06 2.41,41.91 10.03,33.02 | 11.3,120.65 E34.6 | E34.5 11.3,123.19 | J1.8 v17.65,172.72 | v25.27,172.72 J1.9 | E10.11 E10.10 E7.8 203.07,24.13 | E10.1 177.67,48.26 177.67,43.18 | 177.67,43.18 E10.5 E10.6 | 177.67,43.18 177.67,21.59 | E16.1 137.03,49.53 137.03,43.18 | 137.03,43.18 E16.5 E16.6 | 137.03,43.18 137.03,39.37 133.22,35.56 119.25,35.56 | 217.04,43.18 E4.5 E4.6 | E25.1 76.07,50.8 76.07,43.18
IF0_IN  (via drill 0.81)
  Top 0.406: v27.81,167.64 v83.69,167.64
  Bottom 0.406: J1.15 29.08,186.69 29.08,171.45 27.81,170.18 v27.81,167.64 | E27.13 83.69,182.88 v83.69,167.64
IF1_IN  (via drill 0.81)
  Top 0.406: v26.54,163.83 v82.42,163.83
  Bottom 0.406: J1.14 27.81,185.42 27.81,171.45 26.54,170.18 v26.54,163.83 | E27.4 82.42,181.61 v82.42,163.83
IF2_IN  (via drill 0.81)
  Top 0.406: v25.27,160.02 v81.15,160.02
  Bottom 0.406: J1.13 26.54,184.15 26.54,171.45 25.27,170.18 v25.27,160.02 | E27.5 81.15,180.34 v81.15,160.02
INTERNAL_IO  (via drill 0.81)
  Top 0.406: v133.22,31.75 R9.1 133.22,43.18 E16.2
  Bottom 0.406: Q1.2 93.85,31.75 | 93.85,31.75 R6.2 | v133.22,31.75 93.85,31.75
IOT2X5  (via drill 0.81)
  Top 0.406: v59.56,139.06 v116.71,139.06 v175.13,139.06
  Bottom 0.406: E12.3 175.13,181.61 v175.13,139.06 | v116.71,139.06 116.71,109.22 115.44,107.95 115.44,59.69 111.63,52.07 111.63,43.18 109.09,40.64 E22.9 E22.8 | E29.3 60.83,116.84 60.83,121.92 59.56,123.19 v59.56,139.06
IOT2X_45  (via drill 0.81)
  Top 0.406: v53.21,126.36 v106.55,126.36 v190.37,126.36
  Bottom 0.406: E12.1 185.29,189.23 185.29,167.64 187.83,165.1 187.83,143.51 190.37,140.97 v190.37,126.36 | E24.11 105.28,184.15 105.28,162.56 106.55,158.75 v106.55,126.36 | E30.3 53.21,182.88 v53.21,126.36
IOT_FETCH  (via drill 0.81)
  Top 0.406: v119.25,129.54 v178.94,129.54 v225.93,129.54
  Bottom 0.406: E12.5 178.94,180.34 v178.94,129.54 | E21.4 116.71,181.61 116.71,151.13 119.25,148.59 v119.25,129.54 | v225.93,129.54 225.93,116.84 E5.3
LOAD_CNTL
  Bottom 0.406: E16.9 158.62,34.29 172.59,20.32 172.59,8.89 172.28,8.57 U$2.BH2
LRM  (via drill 0.81)
  Top 0.406: v187.83,137.16 v172.59,137.16 v135.76,137.16 v18.92,137.16
  Bottom 0.406: E34.13 20.19,109.22 20.19,135.89 v18.92,137.16 | v187.83,137.16 187.83,118.11 E11.13 | v172.59,137.16 172.59,179.07 E15.10 | v135.76,137.16 135.76,124.46 138.3,121.92 138.3,96.52 139.57,95.25 139.57,59.69 135.76,55.88 135.76,46.99 129.41,40.64 E19.9 E19.8
LTM  (via drill 0.81)
  Top 0.406: v102.74,76.2 v96.39,76.2 | v100.2,156.21 v120.52,156.21 v135.76,156.21 v154.81,156.21 v181.48,156.21
  Bottom 0.406: v102.74,76.2 102.74,55.88 101.47,54.61 101.47,53.34 E22.2 E22.3 91.31,48.26 JP1.2 | v181.48,156.21 E11.1 | E15.2 152.27,181.61 152.27,158.75 v154.81,156.21 | v135.76,156.21 134.49,154.94 134.49,124.46 137.03,121.92 137.03,96.52 138.3,95.25 138.3,59.69 134.49,55.88 134.49,50.8 129.41,48.26 E19.12 E19.11 | v120.52,156.21 120.52,120.65 E20.1 | v100.2,156.21 100.2,120.65 E23.1 97.66,118.11 97.66,111.76 95.12,109.22 95.12,85.09 96.39,83.82 v96.39,76.2
MD00  (via drill 0.81)
  Top 0.406: v214.5,95.89 v231.01,95.89
  Bottom 0.406: v231.01,95.89 E4.14 | E8.13 214.5,107.95 v214.5,95.89
MD01  (via drill 0.81)
  Top 0.406: v211.96,92.08 v233.55,92.08
  Bottom 0.406: v233.55,92.08 233.55,53.34 E4.13 | E8.12 211.96,107.95 v211.96,92.08
MD02  (via drill 0.81)
  Top 0.406: v200.53,90.81 v224.66,90.81
  Bottom 0.406: E8.5 200.53,106.68 v200.53,90.81 | E4.3 225.93,50.8 225.93,55.88 224.66,57.15 v224.66,90.81 224.66,105.41 E5.6 E5.5 E5.11 E5.12
MD03  (via drill 0.81)
  Top 0.406: v64.64,93.98 v134.49,93.98 v199.26,93.98 v223.39,93.98
  Bottom 0.406: v223.39,93.98 223.39,55.88 224.66,54.61 224.66,52.07 E4.2 | E8.4 199.26,107.95 v199.26,93.98 | E20.14 129.41,114.3 134.49,109.22 v134.49,93.98 | v64.64,93.98 64.64,105.41 E29.9 62.1,110.49 62.1,120.65 64.64,123.19 64.64,171.45 62.1,173.99 62.1,184.15 E30.12
MD04  (via drill 0.81)
  Top 0.406: v134.49,62.23 v168.78,62.23 v190.37,62.23
  Bottom 0.406: E20.11 131.95,101.6 131.95,69.85 v134.49,62.23 | E10.14 v190.37,62.23 | E14.13 173.86,106.68 173.86,85.09 168.78,74.93 v168.78,62.23
MD05  (via drill 0.81)
  Top 0.406: v67.18,92.08 v117.98,92.08 v168.78,92.08 v187.83,92.08
  Bottom 0.406: E10.13 187.83,53.34 v187.83,92.08 | E14.12 171.32,106.68 171.32,94.61 v168.78,92.08 | v117.98,92.08 117.98,99.06 116.71,100.33 116.71,106.68 E20.5 | E30.11 63.37,182.88 63.37,173.99 65.91,171.45 65.91,123.19 63.37,120.65 63.37,111.76 E29.10 67.18,107.95 v67.18,92.08
MD06  (via drill 0.81)
  Top 0.406: v184.02,87.63 v159.89,87.63 v114.17,87.63 | E14.5 E17.15 E17.1 | E18.1 E18.15
  Bottom 0.406: v184.02,87.63 184.02,57.15 185.29,55.88 185.29,50.8 E10.3 | E14.5 159.89,107.95 v159.89,87.63 | E23.14 109.09,114.3 114.17,109.22 v114.17,87.63 | E18.1 140.84,191.77 E17.1
MD07  (via drill 0.81)
  Top 0.406: v111.63,78.11 v143.38,78.11 v157.35,78.11 v181.48,78.11
  Bottom 0.406: v181.48,78.11 181.48,57.15 184.02,54.61 184.02,52.07 E10.2 | E18.3 143.38,186.69 143.38,116.84 E17.3 145.92,109.22 145.92,99.06 144.65,97.79 144.65,82.55 143.38,81.28 v143.38,78.11 | E14.4 158.62,107.95 158.62,100.33 157.35,99.06 v157.35,78.11 | E23.11 111.63,101.6 v111.63,78.11
MD08  (via drill 0.81)
  Top 0.406: v51.94,88.9 v67.18,88.9 v96.39,88.9 v147.19,88.9
  Bottom 0.406: E32.13 51.94,105.41 v51.94,88.9 | v147.19,88.9 147.19,110.49 E17.13 144.65,115.57 144.65,180.34 E18.13 | E28.14 67.18,54.61 v67.18,88.9 | E23.5 96.39,106.68 v96.39,88.9
MD09  (via drill 0.81)
  Top 0.406: v50.67,68.58 v69.72,68.58
  Bottom 0.406: E32.12 49.4,105.41 49.4,73.66 50.67,72.39 v50.67,68.58 | E28.13 69.72,54.61 v69.72,68.58
MD10  (via drill 0.81)
  Top 0.406: v36.7,93.98 v62.1,93.98
  Bottom 0.406: v36.7,93.98 36.7,107.95 E32.5 | E28.3 62.1,52.07 v62.1,93.98 62.1,105.41 E29.5 55.75,111.76 55.75,180.34 E30.5
MD11  (via drill 0.81)
  Top 0.406: v35.43,90.81 v59.56,90.81
  Bottom 0.406: v35.43,90.81 35.43,109.22 E32.4 | E28.2 59.56,52.07 v59.56,90.81
MME  (via drill 0.81)
  Top 0.406: v247.52,76.2 v189.1,76.2 v105.28,76.2
  Bottom 0.406: E3.5 246.25,181.61 246.25,113.03 247.52,111.76 v247.52,76.2 | E22.6 104.01,45.72 104.01,54.61 105.28,55.88 v105.28,76.2 | E11.9 187.83,105.41 187.83,101.6 189.1,100.33 v189.1,76.2
N$1  (via drill 0.81)
  Top 0.406: v22.73,57.15 v246.25,57.15
  Bottom 0.406: E34.36 26.54,120.65 26.54,99.06 22.73,95.25 v22.73,57.15 | v246.25,57.15 246.25,109.22 E2.4
N$2  (via drill 0.81)
  Top 0.406: v20.83,59.05 v243.71,59.05
  Bottom 0.406: E34.37 25.27,121.92 25.27,100.33 20.83,95.89 v20.83,59.05 | v243.71,59.05 243.71,96.52 244.98,97.79 244.98,107.95 E2.5
N$3  (via drill 0.81)
  Top 0.406: v18.92,60.96 v248.79,60.96
  Bottom 0.406: E34.38 22.73,121.92 22.73,100.33 18.92,96.52 v18.92,60.96 | v248.79,60.96 248.79,106.68 E2.12
N$4  (via drill 0.81)
  Top 0.406: v81.15,85.09 v125.6,85.09
  Bottom 0.406: v81.15,85.09 81.15,95.25 82.42,96.52 82.42,113.03 E26.15 | E20.12 125.6,107.95 v125.6,85.09
N$5  (via drill 0.81)
  Top 0.406: v79.88,86.36 v120.52,86.36
  Bottom 0.406: E20.7 121.79,101.6 121.79,96.52 120.52,95.25 v120.52,86.36 | v79.88,86.36 79.88,102.87 E26.7
N$6  (via drill 0.81)
  Top 0.406: v91.31,83.19 v175.13,83.19
  Bottom 0.406: E11.3 175.13,110.49 v175.13,83.19 | E26.12 91.31,104.14 v91.31,83.19
N$10
  Top 0.406: E1.8 255.14,38.1 | 255.14,38.1 R3.1 | C9.+ 255.14,38.1
N$11  (via drill 0.81)
  Top 0.406: v205.61,157.48 v225.93,157.48 v258.95,157.48 | E9.1 E9.2 204.34,189.23 204.34,186.69 E9.4 E9.5
  Bottom 0.406: E1.9 256.41,45.72 258.95,52.07 v258.95,157.48 | E6.5 225.93,181.61 v225.93,157.48 | E9.5 205.61,180.34 v205.61,157.48
N$12  (via drill 0.81)
  Top 0.406: v21.46,201.93 v258.95,201.93
  Bottom 0.406: E1.10 255.14,46.99 256.41,49.53 256.41,127 257.68,134.62 257.68,161.29 258.95,162.56 v258.95,201.93 | J1.6 21.46,184.15 v21.46,201.93
N$16
  Top 0.406: E34.16 16.38,95.25 | 16.38,95.25 26.54,85.09 E34.21 | 16.38,95.25 16.38,110.49 E34.9 E34.8
  Bottom 0.406: E34.16 R2.1
N$18  (via drill 0.81)
  Top 0.406: v204.34,170.18 v256.41,170.18
  Bottom 0.406: R3.2 255.14,132.08 256.41,137.16 v256.41,170.18 | E9.6 204.34,179.07 v204.34,170.18
N$20  (via drill 0.81)
  Top 0.406: v87.5,78.11 v107.82,78.11
  Bottom 0.406: E23.12 105.28,107.95 105.28,87.63 v107.82,78.11 | v87.5,78.11 87.5,100.33 E26.9
N$21  (via drill 0.81)
  Top 0.406: v83.69,68.58 v125.6,68.58
  Bottom 0.406: E20.9 128.14,100.33 128.14,80.01 125.6,77.47 v125.6,68.58 | v83.69,68.58 83.69,111.76 E26.14
N$22  (via drill 0.81)
  Top 0.406: v50.67,142.88 v90.04,142.88 | v54.48,62.23 v96.39,62.23 | v90.04,167.64 v194.18,167.64 v251.33,167.64
  Bottom 0.406: v54.48,62.23 54.48,95.25 50.67,125.73 v50.67,142.88 | v90.04,142.88 v90.04,167.64 90.04,173.99 E27.10 | E2.13 247.52,115.57 247.52,129.54 251.33,133.35 v251.33,167.64 | v194.18,167.64 194.18,114.3 E11.10 | JP1.1 96.39,60.96 v96.39,62.23
N$29  (via drill 0.81)
  Top 0.406: v107.82,87.63 v88.77,87.63
  Bottom 0.406: E23.9 107.82,100.33 v107.82,87.63 | v88.77,87.63 88.77,101.6 E26.10
N$31
  Top 0.406: E23.7 E26.11
N$32  (via drill 0.81)
  Top 0.406: v34.16,129.54 v114.17,129.54
  Bottom 0.406: v34.16,129.54 34.16,139.7 11.3,160.02 11.3,185.42 J1.2 | v114.17,129.54 114.17,142.24 115.44,143.51 115.44,187.96 E21.1
N$33  (via drill 0.81)
  Top 0.406: v83.69,160.02 v96.39,160.02
  Bottom 0.406: R10.2 76.07,109.22 E26.6 81.15,109.22 81.15,114.3 83.69,116.84 v83.69,160.02 | E24.3 96.39,185.42 v96.39,160.02
N$42  (via drill 0.81)
  Top 0.406: v213.23,123.19 v251.33,123.19
  Bottom 0.406: E2.15 248.79,119.38 248.79,120.65 v251.33,123.19 | v213.23,123.19 213.23,177.8 E9.9 E9.10
N$45  (via drill 0.81)
  Top 0.406: v130.68,123.19 v82.42,123.19
  Bottom 0.406: E26.5 E26.4 E26.3 82.42,118.11 v82.42,123.19 | E21.8 128.14,125.73 v130.68,123.19
N$48  (via drill 0.81)
  Top 0.406: v69.72,128.27 v180.21,128.27
  Bottom 0.406: v69.72,128.27 69.72,176.53 E30.9 | E12.6 180.21,179.07 v180.21,128.27
N$51  (via drill 0.81)
  Top 0.406: v233.55,133.35 v40.51,133.35
  Bottom 0.406: E33.1 31.62,186.69 31.62,166.37 30.35,165.1 30.35,148.59 40.51,138.43 v40.51,133.35 | E6.9 233.55,179.07 v233.55,133.35
N$52  (via drill 0.81)
  Top 0.406: v192.28,134.62 v21.46,134.62
  Bottom 0.406: E34.15 21.46,105.41 v21.46,134.62 | v192.28,134.62 192.28,114.94 E11.11
N$54  (via drill 0.81)
  Top 0.406: v16.38,139.06 v44.32,139.06
  Bottom 0.406: E34.4 17.65,129.54 17.65,134.62 16.38,135.89 v16.38,139.06 | E33.7 39.24,176.53 39.24,144.15 v44.32,139.06
N$55  (via drill 0.81)
  Top 0.406: v15.11,140.97 v45.59,140.97
  Bottom 0.406: E34.3 16.38,130.81 16.38,134.62 15.11,135.89 v15.11,140.97 | E33.4 40.51,182.88 40.51,146.05 v45.59,140.97
N$56  (via drill 0.81)
  Top 0.406: v12.57,142.88 v46.86,142.88
  Bottom 0.406: E34.2 15.11,132.08 15.11,134.62 12.57,137.16 v12.57,142.88 | v46.86,142.88 43.05,146.69 43.05,158.75 44.32,160.02 44.32,181.61 E33.12
N$59  (via drill 0.81)
  Top 0.406: v72.26,140.97 v130.68,140.97 v243.71,140.97 v255.14,140.97
  Bottom 0.406: v255.14,140.97 255.14,180.34 E3.10 | E2.1 v243.71,140.97 | E21.11 130.68,182.88 v130.68,140.97 | E27.1 70.99,185.42 70.99,142.24 v72.26,140.97
N$60
  Top 0.406: C10.+ R4.1 E11.12
N$71
  Top 0.406: E1.6 247.52,44.45 247.52,48.26 | 247.52,48.26 E1.3 | E1.11 248.79,48.26 247.52,48.26
  Bottom 0.406: E3.8 253.87,176.53 253.87,48.26 E1.11
N$72
  Bottom 0.406: E1.5 238.63,46.99 238.63,111.76 E2.2
N$73
  Bottom 0.406: E1.2 241.17,53.34 241.17,101.6 E2.7
N$74
  Bottom 0.406: E1.12 252.6,49.53 252.6,102.87 E2.10
N$77
  Bottom 0.406: E31.11 44.32,40.64 43.05,41.91 43.05,114.3 E32.15
N$78
  Bottom 0.406: E31.14 44.32,49.53 44.32,102.87 E32.10
N$80
  Bottom 0.406: E31.5 39.24,43.18 41.78,45.72 41.78,113.03 E32.2
N$81
  Bottom 0.406: E31.2 40.51,53.34 40.51,101.6 E32.7
N$83
  Bottom 0.406: E13.11 166.24,43.18 166.24,114.3 E14.15
N$84
  Bottom 0.406: E13.14 167.51,49.53 167.51,102.87 E14.10
N$86
  Bottom 0.406: E13.5 164.97,46.99 164.97,113.03 E14.2
N$87
  Bottom 0.406: E13.2 163.7,53.34 163.7,101.6 E14.7
N$89
  Bottom 0.406: E7.11 206.88,44.45 206.88,113.03 E8.15
N$90
  Bottom 0.406: E7.14 208.15,50.8 208.15,101.6 E8.10
N$91  (via drill 0.81)
  Top 0.406: R8.2 96.39,50.8 E22.1 | v126.87,161.29 v97.66,161.29 | v93.85,67.31 v101.47,67.31
  Bottom 0.406: E22.1 101.47,55.88 v101.47,67.31 | E21.10 126.87,181.61 v126.87,161.29 | v97.66,161.29 97.66,144.78 98.93,143.51 98.93,124.46 97.66,123.19 97.66,119.38 96.39,118.11 96.39,111.76 93.85,109.22 v93.85,67.31
N$92
  Bottom 0.406: E7.5 205.61,45.72 205.61,114.3 E8.2
N$93
  Bottom 0.406: E7.2 204.34,52.07 204.34,102.87 E8.7
N$94
  Top 0.406: C11.+ R5.1 E11.2
N$97
  Top 0.406: R7.2 Q1.3
N$143  (via drill 0.81)
  Top 0.406: v32.89,154.94 v72.26,154.31
  Bottom 0.406: E33.2 32.89,185.42 v32.89,154.94 | E27.2 72.26,184.15 v72.26,154.31
N$145  (via drill 0.81)
  Top 0.406: v36.7,153.03 v78.61,153.03
  Bottom 0.406: E33.5 35.43,180.34 35.43,167.64 36.7,166.37 v36.7,153.03 | E27.7 77.34,176.53 77.34,172.72 78.61,171.45 v78.61,153.03
N$149  (via drill 0.81)
  Top 0.406: v48.13,156.21 v91.31,156.21
  Bottom 0.406: v48.13,156.21 48.13,185.42 E33.14 | v91.31,156.21 91.31,186.69 87.5,190.5 E27.15
N$167  (via drill 0.81)
  Top 0.406: v20.19,196.85 v105.28,196.85 R1.1
  Bottom 0.406: J1.5 20.19,185.42 v20.19,196.85 | E12.10 186.56,185.42 R1.1 | E24.13 105.28,191.77 v105.28,196.85
N$185  (via drill 0.81)
  Top 0.406: v54.48,170.18 v129.41,170.18 v195.45,170.18
  Bottom 0.406: E30.4 54.48,181.61 v54.48,170.18 | E12.11 190.37,185.42 195.45,180.34 v195.45,170.18 195.45,110.49 E11.8 | E21.9 129.41,179.07 v129.41,170.18
N$213  (via drill 0.81)
  Top 0.406: v120.52,163.83 v87.5,163.83
  Bottom 0.406: E21.3 123.06,185.42 123.06,176.53 120.52,173.99 v120.52,163.83 | E27.9 87.5,173.99 v87.5,163.83
N$218  (via drill 0.81)
  Top 0.406: v112.9,144.15 200.53,144.15 v247.52,144.78
  Bottom 0.406: E24.12 112.9,181.61 v112.9,144.15 | E3.12 247.52,182.88 v247.52,144.78
N$277  (via drill 0.81)
  Top 0.406: v98.93,62.23 v131.95,62.23 | v133.22,53.34 134.49,54.61 151,54.61 v152.27,53.34 | v156.08,80.01 v251.33,80.01
  Bottom 0.406: E25.13 87.5,52.07 90.04,52.07 98.93,60.96 v98.93,62.23 | v131.95,62.23 131.95,54.61 v133.22,53.34 | v152.27,53.34 156.08,57.15 v156.08,80.01 | v251.33,80.01 E2.9
N$308
  Top 0.406: E18.2 E18.14
  Bottom 0.406: E12.2 175.13,196.85 158.62,196.85 E18.14
N$322  (via drill 0.81)
  Top 0.406: v119.25,152.4 v217.04,152.4
  Bottom 0.406: E6.1 217.04,185.42 v217.04,152.4 | E21.6 117.98,177.8 117.98,153.67 v119.25,152.4
N$338
  Top 0.406: E6.6 E9.12 E9.13
N$406  (via drill 0.81)
  Top 0.406: v104.01,158.75 v159.89,158.75
  Bottom 0.406: E15.4 156.08,180.34 156.08,162.56 v159.89,158.75 | v104.01,158.75 104.01,80.01 106.55,77.47 106.55,55.88 105.28,54.61 105.28,49.53 E22.12 E22.11
N$409  (via drill 0.81)
  Top 0.406: v173.86,163.83 v124.33,163.83
  Bottom 0.406: E15.12 173.86,182.88 v173.86,163.83 | v124.33,163.83 124.33,78.74 123.06,73.66 123.06,50.8 | 123.06,50.8 123.06,46.99 E19.5 E19.6 | 123.06,50.8 E19.2 E19.3
SKME  (via drill 0.81)
  Top 0.406: v102.74,160.02 v162.43,160.02
  Bottom 0.406: E15.6 159.89,179.07 159.89,162.56 v162.43,160.02 | E22.5 102.74,46.99 102.74,54.61 104.01,55.88 104.01,77.47 102.74,78.74 v102.74,160.02
TP2  (via drill 0.81)
  Top 0.406: v170.05,158.75 217.04,158.75
  Bottom 0.406: v170.05,158.75 168.78,157.48 168.78,124.46 166.24,121.92 161.16,121.92 159.89,120.65 159.89,113.03 157.35,107.95 156.08,101.6 156.08,86.36 149.73,80.01 149.73,57.15 145.92,53.34 145.92,30.48 143.38,27.94 117.98,27.94 115.44,25.4 115.44,8.26 U$2.CE2
TP3
  Bottom 0.406: E16.4 143.38,43.18 143.38,31.75 140.84,29.21 111.63,29.21 109.09,26.67 109.09,8.26 U$2.CH2
TP4
  Bottom 0.406: U$2.CJ2 105.28,7.62 105.28,21.59 101.47,25.4 86.23,25.4 84.96,26.67 84.96,39.37 E25.9
TRAP  (via drill 0.81)
  Top 0.406: v34.16,95.89 v45.59,95.89 v168.78,95.89 v210.69,95.89
  Bottom 0.406: v34.16,95.89 34.16,119.38 37.97,123.19 37.97,139.7 15.11,160.02 15.11,176.53 J1.7 | v45.59,95.89 E32.9 | E8.9 v210.69,95.89 | E14.9 v168.78,95.89
UF_IN  (via drill 0.81)
  Top 0.406: v22.73,157.48 v84.96,157.48
  Bottom 0.406: J1.16 22.73,191.77 22.73,184.15 18.92,180.34 18.92,161.29 v22.73,157.48 | E27.12 84.96,181.61 v84.96,157.48
USETM
  Top 0.406: E24.8 E21.5
VCC
  Top 0.813: C1.+ 30.35,55.88 45.59,55.88 | 45.59,55.88 E31.16 | E28.8 68.45,40.64 68.45,55.88 | 68.45,55.88 45.59,55.88 | 68.45,55.88 91.31,55.88 | 91.31,55.88 R7.1 91.31,43.18 E25.8 | 91.31,55.88 93.85,55.88 | R6.1 93.85,55.88 | 93.85,55.88 R8.1 106.55,55.88 | 106.55,55.88 115.44,55.88 | 115.44,55.88 126.87,55.88 | 126.87,55.88 E19.14 | E22.14 106.55,55.88 | 153.54,55.88 153.54,43.18 E16.8 135.76,30.48 128.14,24.13 128.14,21.59 C14.+ | 153.54,55.88 126.87,55.88 | E13.16 168.78,55.88 | 168.78,55.88 153.54,55.88 | 195.45,55.88 195.45,43.18 E10.8 191.64,36.83 191.64,22.86 C13.+ | 195.45,55.88 168.78,55.88 | E7.16 210.69,55.88 | 210.69,55.88 195.45,55.88 | E4.8 236.09,43.18 236.09,55.88 | 236.09,55.88 210.69,55.88 | 236.09,55.88 248.79,55.88 E1.14 C3.+ | C12.+ 260.22,39.37 262.76,41.91 C3.+ | E32.16 45.59,121.28 | 45.59,121.28 39.88,121.28 E32.1 35.43,116.84 35.43,106.68 31.62,102.87 E34.28 | E29.8 70.99,104.14 73.53,106.68 73.53,121.28 | 73.53,121.28 45.59,121.28 | 73.53,121.28 R10.1 86.23,121.28 | 86.23,121.28 106.55,121.28 | 106.55,121.28 126.87,121.28 | 126.87,121.28 148.46,121.28 | 148.46,121.28 161.16,121.28 | 161.16,121.28 168.78,121.28 | 168.78,121.28 189.1,121.28 | E23.16 106.55,121.28 | E20.16 126.87,121.28 | E17.16 148.46,121.28 | E14.16 168.78,121.28 | E11.14 189.1,121.28 | 189.1,121.28 210.69,121.28 | 210.69,121.28 237.36,121.28 | 237.36,121.28 251.33,121.28 | 251.33,121.28 E2.16 | E8.16 210.69,121.28 | E5.8 234.82,104.14 237.36,106.68 237.36,121.28 | E33.16 45.59,194.94 | 45.59,194.94 12.57,194.94 10.03,192.41 10.03,118.11 | 10.03,118.11 10.03,110.49 | 10.03,110.49 E34.10 | E30.8 68.45,177.8 69.72,179.07 69.72,194.94 | 69.72,194.94 50.67,194.94
  Top 0.813: 50.67,194.94 45.59,194.94 | 69.72,194.94 86.23,194.94 | 86.23,194.94 106.55,194.94 | 106.55,194.94 128.14,194.94 | 128.14,194.94 134.49,194.94 | 134.49,194.94 149.73,194.94 | 149.73,194.94 168.78,194.94 | 168.78,194.94 189.1,194.94 | 189.1,194.94 196.72,194.94 | 196.72,194.94 210.69,194.94 | 210.69,194.94 232.28,194.94 | 232.28,194.94 252.6,194.94 | 252.6,194.94 C5.+ 264.03,192.41 264.03,54.61 C3.+ | E3.14 252.6,194.94 | 232.28,194.94 E6.14 229.74,190.5 229.74,185.42 | E9.14 210.69,194.94 | E12.14 189.1,194.94 | E15.14 168.78,194.94 | E18.16 149.73,194.94 | E21.14 128.14,194.94 | E24.14 106.55,194.94 | E27.16 86.23,194.94 | 10.03,118.11 E34.7 E34.28 | E34.14 10.03,100.33 | 10.03,100.33 10.03,105.41 | 10.03,105.41 10.03,110.49 | 10.03,100.33 10.03,80.01 C2.+ | 251.33,121.28 C4.+ | C6.+ 115.44,55.88 | C7.+ 50.67,194.94 | C8.+ 134.49,194.94 | R1.2 196.72,194.94 | R2.2 10.03,105.41 | E34.28 E34.27 | E26.16 86.23,121.28 | 229.74,185.42 E6.10 | E6.4 229.74,185.42 | E14.1 161.16,121.28
  Bottom 0.813: U$2.CA2 128.14,8.26 128.14,19.05 C14.+ | U$2.AA2 261.49,8.26 261.49,20.32 C12.+ | U$2.BA2 191.64,7.94 191.64,20.32 C13.+

## Text on the board
Top: DMM | 8E | 2
Bottom: MEMORY | COPYRIGHT | MANAGEMENT | DIGICOS
tPlace: X
200bmp: //wsl$/Debian/home/vrs/Eagle/projects/DEC/DMM-8E/DMM-8E-2front.bmp